# Altium project Time4CM4_PCIeCarrier.PrjPcb (part 2 of 2)

## Sheet Dip_Switch.SchDoc
size A4; SheetNumber: 7; SheetTotal: 12
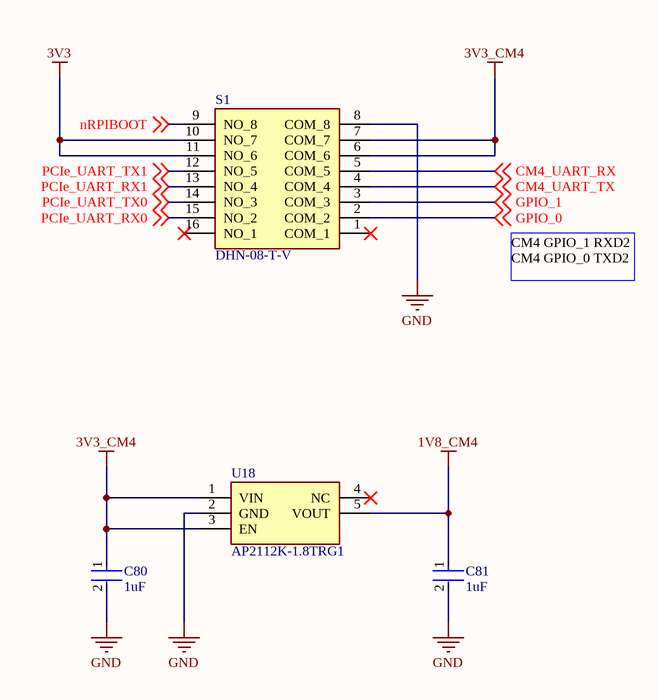
[diagram p7: Dip_Switch.SchDoc]

### Parts
C80  1uF  [FP-CC0805-0_85-MFG]
C81  1uF  [FP-CC0805-0_85-MFG]
S1  DHN-08-T-V  [DHN08TV]
U18  AP2112K-1.8TRG1  [SOT95P285X140-5N]

### Nets
1V8_CM4: C81.1 U18.5(VOUT)
3V3: S1.10(NO_7) S1.11(NO_6)
3V3_CM4: C80.1 S1.6(COM_6) S1.7(COM_7) U18.1(VIN) U18.3(EN)
GND: C80.2 C81.2 S1.8(COM_8) U18.2(GND)
CM4_UART_RX: S1.5(COM_5) ; off-sheet CM4_UART_RX
CM4_UART_TX: S1.4(COM_4) ; off-sheet CM4_UART_TX
GPIO_0: S1.2(COM_2) ; off-sheet GPIO_0
GPIO_1: S1.3(COM_3) ; off-sheet GPIO_1
nRPIBOOT: S1.9(NO_8) ; off-sheet nRPIBOOT
PCIe_UART_RX0: S1.15(NO_2) ; off-sheet PCIe_UART_RX0
PCIe_UART_RX1: S1.13(NO_4) ; off-sheet PCIe_UART_RX1
PCIe_UART_TX0: S1.14(NO_3) ; off-sheet PCIe_UART_TX0
PCIe_UART_TX1: S1.12(NO_5) ; off-sheet PCIe_UART_TX1

Not connected (* = marked no-connect by the designer): S1 1(COM_1)* 16(NO_1)*; U18 4(NC)*

### Notes on the sheet
- CM4 GPIO_1 RXD2
  CM4 GPIO_0 TXD2

### Library data of the parts
C80 C81 = CMP-03422-000182-1: CAP CER 1UF 10V X7R 0805; Manufacturer: Yageo; Manufacturer Part Number: CC0805KKX7R6BB105; Material: Ceramic; Tolerance: 0.1; Value: 1 uF; ComponentLink2URL: http://www.yageo.com/documents/recent/UPY-GPHC_Y5V_6.3V-to-50V_8.pdf; Automotive: No; Temperature Range Low: -30°C; Octopart: https://octopart.com/cc0805kkx7r6bb105-yageo-42522859; Temperature Characteristic: X7R; RoHS: TRUE; Voltage Rating: 10 V; Capacitance: 1 uF; Package: CC0805-0.85; Device Class L3: Ceramic Capacitors; Category: Cap; Mouser Description: Multilayer Ceramic Capacitors MLCC - SMD/SMT 1.0uF 10V X7R 10%; Temperature Range High: +85°C; Ipc Land Pattern Name: CAPC200125X85; ComponentLink2Description: Datasheet; Temperature: -30°C to +85°C; Height: 0.95mm; Lead Free: Yes; Device Class L1: Passive Components; Device Class L2: Capacitors; Footprint Url: http://www.yageo.com/exep/pages/download/literatures/UPY-C_GEN_24.pdf; Digikey Description: CAP CER 1UF 10V X7R 0805
S1 = DHN-08-T-V: Switch; Manufacturer_Name: Diptronics; Datasheet Link: https://componentsearchengine.com/Datasheets/1/DHN-08-T-V.pdf; Height: 1.65mm; Manufacturer_Part_Number: DHN-08-T-V; Mouser Part Number: 113-DHN-08-T-V; Mouser Price/Stock: https://www.mouser.com/Search/Refine.aspx?Keyword=113-DHN-08-T-V
U18 = AP2112K-1.8TRG1: Integrated Circuit; Manufacturer_Name: Diodes Inc.; Datasheet Link: https://www.diodes.com/assets/Datasheets/AP2112.pdf; Height: 1.4mm; Manufacturer_Part_Number: AP2112K-1.8TRG1; Mouser Part Number: 621-AP2112K-1.8TRG1; Mouser Price/Stock: https://www.mouser.co.uk/ProductDetail/Diodes-Incorporated/AP2112K-1.8TRG1?qs=x6A8l6qLYDBx1xhw8AX2cw%3D%3D; Arrow Part Number: AP2112K-1.8TRG1; Arrow Price/Stock: https://www.arrow.com/en/products/ap2112k-1.8trg1/diodes-incorporated?region=nac

## Sheet 40_Pin_Connector.SchDoc
size A4; SheetNumber: 7; SheetTotal: 11
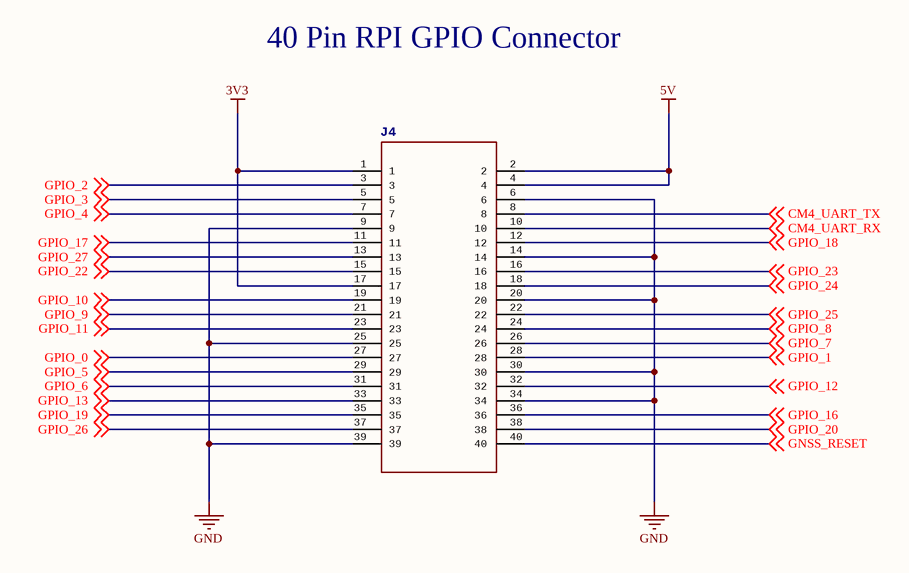
[diagram p8: 40_Pin_Connector.SchDoc]

### Parts
J4  SAMTEC-A-HTSW-120-08-F-DJ  [SAMTEC-A-HTSW-120-08-F-D]  (value not drawn)

### Nets
3V3: J4.1 J4.17
5V: J4.2 J4.4
GND: J4.6 J4.9 J4.14 J4.20 J4.25 J4.30 J4.34 J4.39
CM4_UART_RX: J4.10 ; off-sheet CM4_UART_RX
CM4_UART_TX: J4.8 ; off-sheet CM4_UART_TX
GNSS_RESET: J4.40 ; off-sheet GNSS_RESET
GPIO_0: J4.27 ; off-sheet GPIO_0
GPIO_1: J4.28 ; off-sheet GPIO_1
GPIO_2: J4.3 ; off-sheet GPIO_2
GPIO_3: J4.5 ; off-sheet GPIO_3
GPIO_4: J4.7 ; off-sheet GPIO_4
GPIO_5: J4.29 ; off-sheet GPIO_5
GPIO_6: J4.31 ; off-sheet GPIO_6
GPIO_7: J4.26 ; off-sheet GPIO_7
GPIO_8: J4.24 ; off-sheet GPIO_8
GPIO_9: J4.21 ; off-sheet GPIO_9
GPIO_10: J4.19 ; off-sheet GPIO_10
GPIO_11: J4.23 ; off-sheet GPIO_11
GPIO_12: J4.32 ; off-sheet GPIO_12
GPIO_13: J4.33 ; off-sheet GPIO_13
GPIO_16: J4.36 ; off-sheet GPIO_16
GPIO_17: J4.11 ; off-sheet GPIO_17
GPIO_18: J4.12 ; off-sheet GPIO_18
GPIO_19: J4.35 ; off-sheet GPIO_19
GPIO_20: J4.38 ; off-sheet GPIO_20
GPIO_22: J4.15 ; off-sheet GPIO_22
GPIO_23: J4.16 ; off-sheet GPIO_23
GPIO_24: J4.18 ; off-sheet GPIO_24
GPIO_25: J4.22 ; off-sheet GPIO_25
GPIO_26: J4.37 ; off-sheet GPIO_26
GPIO_27: J4.13 ; off-sheet GPIO_27

### Notes on the sheet
- 40 Pin RPI GPIO Connector

## Sheet PCIe_USB30.SchDoc
size A4; SheetNumber: 9; SheetTotal: 12
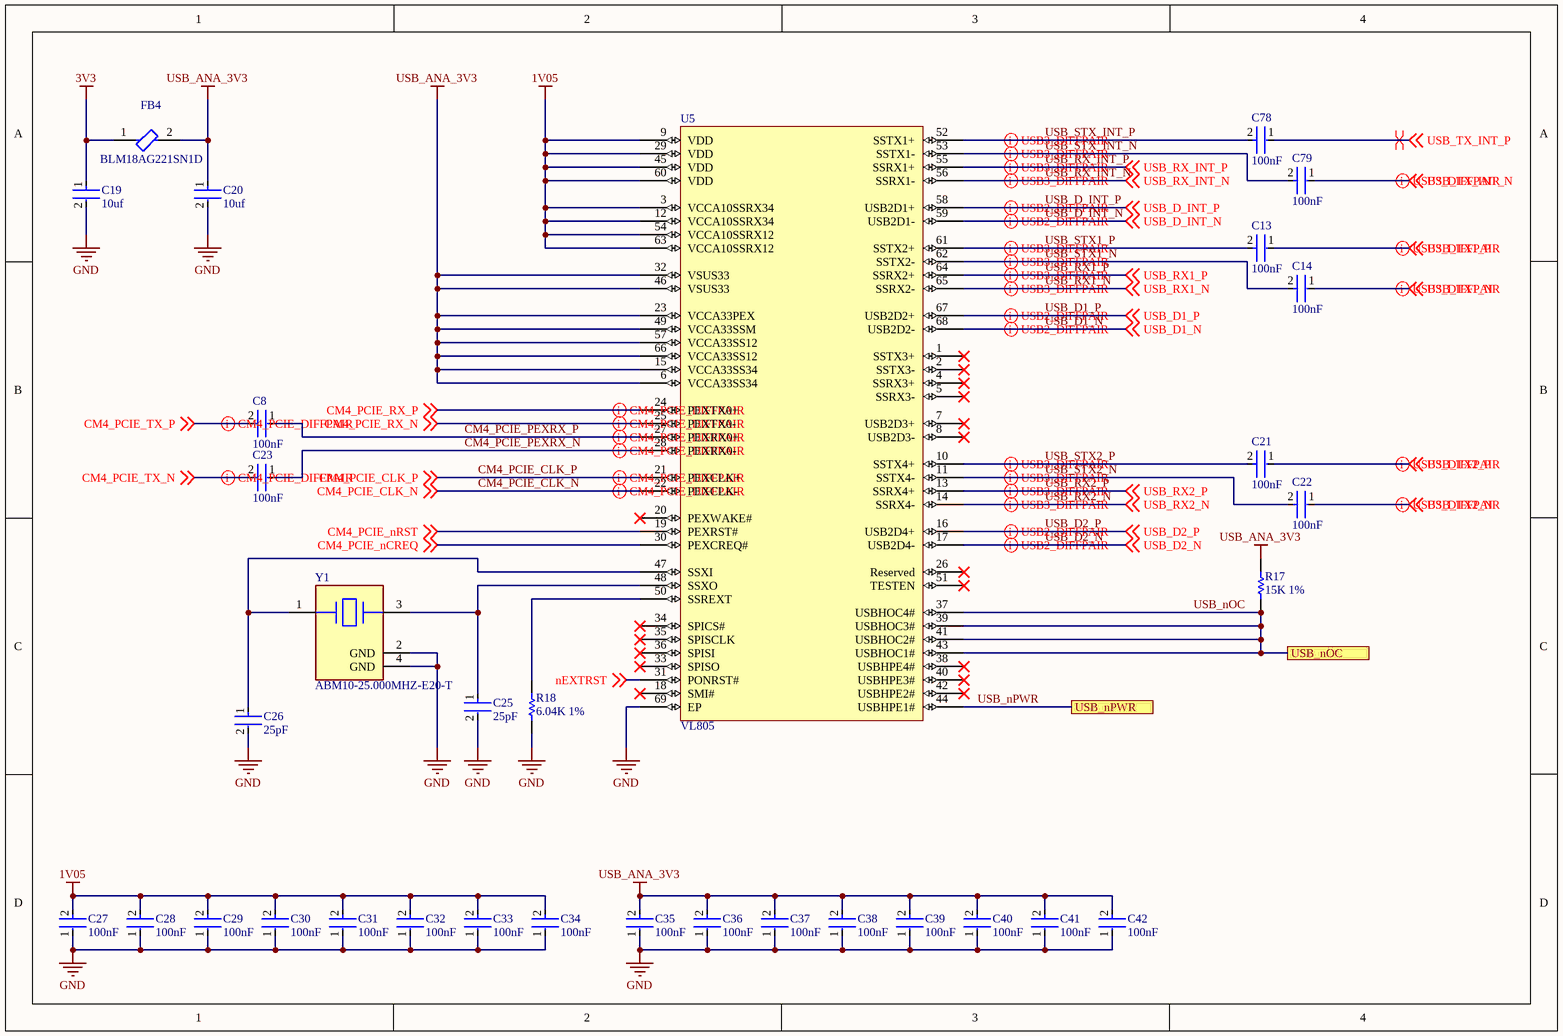
[diagram p9: PCIe_USB30.SchDoc]

### Parts
C8  100nF  [FP-GRM15-MFG]
C13  100nF  [FP-GRM15-MFG]
C14  100nF  [FP-GRM15-MFG]
C19  10uf  [FP-GRM188-0_2-IPC_C]
C20  10uf  [FP-GRM188-0_2-IPC_C]
C21  100nF  [FP-GRM15-MFG]
C22  100nF  [FP-GRM15-MFG]
C23  100nF  [FP-GRM15-MFG]
C25  25pF  [FP-C0402-BB-MFG]
C26  25pF  [FP-C0402-BB-MFG]
C27  100nF  [FP-GRM15-MFG]
C28  100nF  [FP-GRM15-MFG]
C29  100nF  [FP-GRM15-MFG]
C30  100nF  [FP-GRM15-MFG]
C31  100nF  [FP-GRM15-MFG]
C32  100nF  [FP-GRM15-MFG]
C33  100nF  [FP-GRM15-MFG]
C34  100nF  [FP-GRM15-MFG]
C35  100nF  [FP-GRM15-MFG]
C36  100nF  [FP-GRM15-MFG]
C37  100nF  [FP-GRM15-MFG]
C38  100nF  [FP-GRM15-MFG]
C39  100nF  [FP-GRM15-MFG]
C40  100nF  [FP-GRM15-MFG]
C41  100nF  [FP-GRM15-MFG]
C42  100nF  [FP-GRM15-MFG]
C78  100nF  [FP-GRM15-MFG]
C79  100nF  [FP-GRM15-MFG]
FB4  BLM18AG221SN1D  [FP-BLM18-0_15-t0_8-IPC_A]
R17  15K 1%  [RESC1005X40X25ML05T10]
R18  6.04K 1%  [RESC1005X40X25LL05T10]
U5  VL805  [VL805]
Y1  ABM10-25.000MHZ-E20-T  [FP-ABM10-MFG]

### Ports
USB_nOC, USB_nPWR

### Nets
1V05: C27.2 C28.2 C29.2 C30.2 C31.2 C32.2 C33.2 C34.2 U5.3(VCCA10SSRX34) U5.9(VDD) U5.12(VCCA10SSRX34) U5.29(VDD) U5.45(VDD) U5.54(VCCA10SSRX12) U5.60(VDD) U5.63(VCCA10SSRX12)
3V3: C19.1 FB4.1
GND: C19.2 C20.2 C25.2 C26.2 C27.1 C28.1 C29.1 C30.1 C31.1 C32.1 C33.1 C34.1 C35.1 C36.1 C37.1 C38.1 C39.1 C40.1 C41.1 C42.1 R18.1 U5.69(EP) Y1.2(GND) Y1.4(GND)
USB_ANA_3V3: C20.1 C35.2 C36.2 C37.2 C38.2 C39.2 C40.2 C41.2 C42.2 FB4.2 R17.2 U5.6(VCCA33SS34) U5.15(VCCA33SS34) U5.23(VCCA33PEX) U5.32(VSUS33) U5.46(VSUS33) U5.49(VCCA33SSM) U5.57(VCCA33SS12) U5.66(VCCA33SS12)
CM4_PCIE_CLK_N: U5.22(PEXCLK-) ; off-sheet CM4_PCIE_CLK_N
CM4_PCIE_CLK_P: U5.21(PEXCLK+) ; off-sheet CM4_PCIE_CLK_P
CM4_PCIE_nCREQ: U5.30(PEXCREQ#) ; off-sheet CM4_PCIE_nCREQ
CM4_PCIE_nRST: U5.19(PEXRST#) ; off-sheet CM4_PCIE_nRST
CM4_PCIE_PEXRX_N: C23.1 U5.28(PEXRX0-)
CM4_PCIE_PEXRX_P: C8.1 U5.27(PEXRX0+)
CM4_PCIE_RX_N: U5.25(PEXTX0-) ; off-sheet CM4_PCIE_RX_N
CM4_PCIE_RX_P: U5.24(PEXTX0+) ; off-sheet CM4_PCIE_RX_P
CM4_PCIE_TX_N: C23.2 ; off-sheet CM4_PCIE_TX_N
CM4_PCIE_TX_P: C8.2 ; off-sheet CM4_PCIE_TX_P
nEXTRST: U5.31(PONRST#) ; off-sheet nEXTRST
USB_D1_N: U5.68(USB2D2-) ; off-sheet USB_D1_N
USB_D1_P: U5.67(USB2D2+) ; off-sheet USB_D1_P
USB_D2_N: U5.17(USB2D4-) ; off-sheet USB_D2_N
USB_D2_P: U5.16(USB2D4+) ; off-sheet USB_D2_P
USB_D_INT_N: U5.59(USB2D1-) ; off-sheet USB_D_INT_N
USB_D_INT_P: U5.58(USB2D1+) ; off-sheet USB_D_INT_P
USB_nOC: R17.1 U5.37(USBHOC4#) U5.39(USBHOC3#) U5.41(USBHOC2#) U5.43(USBHOC1#) ; port USB_nOC
USB_nPWR: U5.44(USBHPE1#) ; port USB_nPWR
USB_RX1_N: U5.65(SSRX2-) ; off-sheet USB_RX1_N
USB_RX1_P: U5.64(SSRX2+) ; off-sheet USB_RX1_P
USB_RX2_N: U5.14(SSRX4-) ; off-sheet USB_RX2_N
USB_RX2_P: U5.13(SSRX4+) ; off-sheet USB_RX2_P
USB_RX_INT_N: U5.56(SSRX1-) ; off-sheet USB_RX_INT_N
USB_RX_INT_P: U5.55(SSRX1+) ; off-sheet USB_RX_INT_P
USB_STX1_N: C14.2 U5.62(SSTX2-)
USB_STX1_P: C13.2 U5.61(SSTX2+)
USB_STX2_N: C22.2 U5.11(SSTX4-)
USB_STX2_P: C21.2 U5.10(SSTX4+)
USB_STX_INT_N: C79.2 U5.53(SSTX1-)
USB_STX_INT_P: C78.2 U5.52(SSTX1+)
USB_TX1_N: C14.1 ; off-sheet USB_TX1_N
USB_TX1_P: C13.1 ; off-sheet USB_TX1_P
USB_TX2_N: C22.1 ; off-sheet USB_TX2_N
USB_TX2_P: C21.1 ; off-sheet USB_TX2_P
USB_TX_INT_N: C79.1 ; off-sheet USB_TX_INT_N
USB_TX_INT_P: C78.1 ; off-sheet USB_TX_INT_P
NetC25_1: C25.1 U5.48(SSXO) Y1.3
NetC26_1: C26.1 U5.47(SSXI) Y1.1
NetR18_2: R18.2 U5.50(SSREXT)

Not connected (* = marked no-connect by the designer): U5 1(SSTX3+)* 2(SSTX3-)* 4(SSRX3+)* 5(SSRX3-)* 7(USB2D3+)* 8(USB2D3-)* 18(SMI#)* 20(PEXWAKE#)* 26(Reserved)* 33(SPISO)* 34(SPICS#)* 35(SPISCLK)* 36(SPISI)* 38(USBHPE4#)* 40(USBHPE3#)* 42(USBHPE2#)* 51(TESTEN)*

### Layout directives
differential pair; differential pair class PCIe: CM4_PCIE_CLK_N, CM4_PCIE_CLK_P, CM4_PCIE_PEXRX_N, CM4_PCIE_PEXRX_P, CM4_PCIE_RX_N, CM4_PCIE_RX_P, CM4_PCIE_TX_N, CM4_PCIE_TX_P, USB_TX1_P
differential pair; differential pair class USB3: USB_RX1_N, USB_RX1_P, USB_RX2_N, USB_RX2_P, USB_RX_INT_N, USB_RX_INT_P, USB_STX1_N, USB_STX1_P, USB_STX2_N, USB_STX2_P, USB_STX_INT_N, USB_STX_INT_P, USB_TX1_N, USB_TX2_N, USB_TX2_P, USB_TX_INT_N
differential pair; differential pair class USB2: USB_D1_N, USB_D1_P, USB_D2_N, USB_D2_P, USB_D_INT_N, USB_D_INT_P
differential pair: USB_TX_INT_P

### Library data of the parts
C8 C13 C14 C21-C23 C27-C42 C78 C79 = CMP-2100-03641-2: CAP CER 0.1UF 16V X7R 0402; Manufacturer Part Number: GRM155R71C104KA88D; Manufacturer: Murata; Standoff Height: 0mm; Tolerance: 10%; Voltage Rating: 16Vdc; Material: Ceramic; Capacitance: 0.10μF; Value: 0.10μF; RoHS: TRUE; Temperature Characteristic: X7R; Octopart: https://octopart.com/grm155r71c104ka88d-murata-196880; Digikey Description: CAP CER 0.1UF 16V X7R 0402; Device Class L3: Ceramic Capacitors; Height: 0.55mm; ComponentLink2Description: Datasheet; Temperature Range Low: -55°C; Ipc Land Pattern Name: CAPC10050X219; ComponentLink2URL: https://search.murata.co.jp/Ceramy/image/img/A01X/G101/ENG/GRM155R71H471KA01-01A.pdf; Device Class L1: Passive Components; Lead Free: yes; Category: Cap; Package: GRM15; Temperature: -55°C to +125°C; Device Class L2: Capacitors; Temperature Range High: +125°C; Mouser Description: 0402 0.1 uF 16V ±10 % Tolerance X7R SMT Multilayer Ceramic Capacitor
C19 C20 = CMP-06035-045466-1: Chip Multilayer Ceramic Capacitors for General Purpose, 0603, 10uF, X5R, 15%, 20%, 35V; Case Code (Imperial): 0603; Voltage Rating (DC): 35V; Width: 0.031inch; Dielectric: X5R; Voltage Rating: 35V; Min Operating Temperature: -55°C; Thickness: 0.039inch; Mount: Surface Mount; Case/Package: 0603; Length: 0.063inch; Capacitance: 10uF; Max Operating Temperature: 85°C; Packaging: Tape and Reel; Tolerance: 20%; Case Code (Metric): 1608
C25 C26 = CMP-2008-03091-2: CAP CER 12PF 25V NP0 0402; Manufacturer: Kemet; Manufacturer Part Number: C0402C120J3GACTU; Temperature Coefficient: 15%; Temperature Characteristic: C0G; Material: Ceramic; Tolerance: 0.05; Mouser Description: Cap Ceramic 12pF 25V C0G 5% SMD 0402 125°C Paper T/R; Package: C0402-BB; Height: 0.55mm; Temperature: -55°C to +125°C; RoHS: TRUE; ComponentLink2Description: Datasheet; Capacitance: 12 pF; Temperature Range Low: -55°C; Automotive: No; Device Class L2: Capacitors; ComponentLink2URL: https://content.kemet.com/datasheets/KEM_C1002_X7R_SMD.pdf; Voltage Rating: 25 V; Device Class L1: Passive Components; Value: 12 pF; Digikey Description: CAP CER 12PF 25V NP0 0402; Lead Free: Yes; Category: Cap; Ipc Land Pattern Name: CAPC10050X50; Device Class L3: Ceramic Capacitors; Octopart: https://octopart.com/c0402c120j3gactu-kemet-9143703; Temperature Range High: +125°C
FB4 = CMP-0686-00445-3: Chip Ferrite Bead, 0603, 220Ω @ 100MHz, 0.25Ω, 25%, 700mA; DC Current: 500mA; DC Resistance-Max: 250mR; Shielding: Unshielded; Material: Steel; Impedance: 220R; Number of Lines: 1; Max Operating Temperature: 125°C; Military Standard: Not; Min Operating Temperature: -55°C; Max DC Current: 500mA; Case/Package: 0603; Termination: SMD/SMT; Current Rating: 500mA; REACH SVHC: No SVHC; Depth: 0.8mm; Number of Pins: 2; Radiation Hardening: No; Length: 1.6mm; Packaging: Tape and Reel; Test Frequency: 100MHz; Series: BLM18A; Package Quantity: 1; Tolerance: 25%; Case Code (Imperial): 0603; DC Resistance (DCR): 250mR; Height: 0.8mm; Lead Free: Lead Free; Width: 0.8mm; Case Code (Metric): 1608; RoHS Compliant: Yes; Frequency: 100MHz; Core Material: Ferrite; Number of Circuits: 1; Max Current Rating: 500mA
R17 = CMP-2002-07410-1: Manufacturer: Yageo / Phycomp; Part Number: RC0402FR0715KL
R18 = CMP-2002-07778-1: Part Number: RC0402FR-076K04L; Manufacturer: Yageo
Y1 = CMP-27762-004420-1: Crystal 25MHz ±20ppm 10pF SMD-4 2.5mm x 2mm; ESR (Equivalent Series Resistance): 100R; Frequency Stability: 20ppm; Termination: SMD/SMT; Height: 0.02inch; Depth: 2mm; Lead Free: Lead Free; Case/Package: CSMD; Operating Frequency: 25 MHz; Frequency Tolerance: 20ppm; Tolerance: 20ppm; Width: 2mm; Frequency: 25MHz; Packaging: Tape and Reel; Min Operating Temperature: -20°C; Max Operating Temperature: 70°C; Length: 2.5mm; Series: ABM10; REACH SVHC: No SVHC; Mount: Surface Mount; Package Quantity: 1000; Load Capacitance: 10pF; Number of Pins: 4; Series Resistance: 100R

## Sheet PCIe_USB30_Power.SchDoc
size A4; SheetNumber: 10; SheetTotal: 11
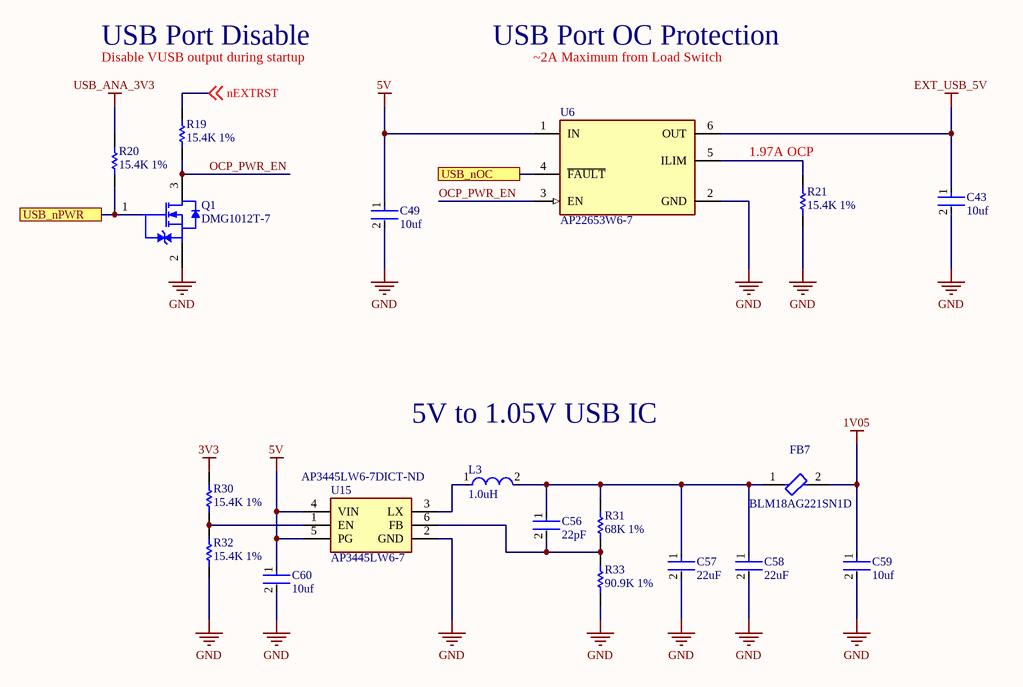
[diagram p10: PCIe_USB30_Power.SchDoc]

### Parts
C43  10uf  [FP-GRM188-0_2-IPC_C]
C49  10uf  [FP-GRM188-0_2-IPC_C]
C56  22pF  [FP-C0603C-CF-MFG]
C57  22uF  [FP-GRM21B-0_15-MFG]
C58  22uF  [FP-GRM21B-0_15-MFG]
C59  10uf  [FP-GRM188-0_2-IPC_C]
C60  10uf  [FP-GRM188-0_2-IPC_C]
FB7  BLM18AG221SN1D  [FP-BLM18-0_15-t0_8-IPC_A]
L3  1.0uH  [FP-NR4018-MFG]
Q1  DMG1012T-7  [DIOD-SOT523-3_V]
R19  15.4K 1%  [RESC1005X40X25ML05T10]
R20  15.4K 1%  [RESC1005X40X25ML05T10]
R21  15.4K 1%  [RESC1005X40X25ML05T10]
R30  15.4K 1%  [RESC1005X40X25ML05T10]
R31  68K 1%  [RESC1005X40X25ML05T05]
R32  15.4K 1%  [RESC1005X40X25ML05T10]
R33  90.9K 1%  [RESC1005X40X25NL05T10]
U6  AP22653W6-7  [FP-SOT26-MFG]
U15  AP3445LW6-7  Supplier Part Number 1: AP3445LW6-7DICT-ND  [SOT95P285X140-6N]

### Ports
USB_nOC, USB_nPWR

### Nets
1V05: C59.1 FB7.2
3V3: R30.2
5V: C49.1 C60.1 U6.1(IN) U15.4(VIN) U15.5(PG)
EXT_USB_5V: C43.1 U6.6(OUT)
GND: C43.2 C49.2 C57.2 C58.2 C59.2 C60.2 Q1.2(S) R21.1 R32.1 R33.1 U6.2(GND) U15.2(GND)
USB_ANA_3V3: R20.2
nEXTRST: R19.2 ; off-sheet nEXTRST
OCP_PWR_EN: Q1.3(D) R19.1 U6.3(EN)
USB_nOC: U6.4(~{FAULT}) ; port USB_nOC
USB_nPWR: Q1.1(G) R20.1 ; port USB_nPWR
NetC56_1: C56.1 C57.1 C58.1 FB7.1 L3.2 R31.1
NetC56_2: C56.2 R31.2 R33.2 U15.6(FB)
NetL3_1: L3.1 U15.3(LX)
NetR21_2: R21.2 U6.5(ILIM)
NetR30_1: R30.1 R32.2 U15.1(EN)

### Notes on the sheet
- USB Port Disable
- Disable VUSB output during startup
- USB Port OC Protection
- ~2A Maximum from Load Switch
- (near R21) 1.97A OCP
- 5V to 1.05V USB IC

### Library data of the parts
C43 C49 C59 C60 = CMP-06035-045466-1: as C19 on sheet PCIe_USB30; Case Code (Imperial): 0603; Voltage Rating (DC): 35V; Width: 0.031inch; Dielectric: X5R; Voltage Rating: 35V; Min Operating Temperature: -55°C; Thickness: 0.039inch; Mount: Surface Mount; Case/Package: 0603; Length: 0.063inch; Capacitance: 10uF; Max Operating Temperature: 85°C; Packaging: Tape and Reel; Tolerance: 20%; Case Code (Metric): 1608
C56 = CMP-1035-00818-3: CAP CER 22PF 50V NP0 0603; Manufacturer Part Number: C0603C220D5GACTU; Manufacturer: KEMET; Temperature Coefficient: 30ppm/°C; Tolerance: 0.5 pF; Automotive Grade: Grade 1; Material: Ceramic; Temperature Characteristic: C0G; Category: Cap; Octopart: https://octopart.com/c0603c220d5gactu-kemet-9143734; Package: C0603C-CF; ComponentLink2Description: Datasheet; Temperature: -55°C to +125°C; RoHS: TRUE; Digikey Description: CAP CER 22PF 50V NP0 0603; Lead Free: Yes; ComponentLink2URL: https://api.kemet.com/component-edge/download/datasheet/C0603C100J5GACAUTO.pdf; Mouser Description: Multilayer Ceramic Capacitors MLCC - SMD/SMT 50volts 22pF C0G 0.5%; Temperature Range Low: -55°C; Temperature Range High: +125°C; Device Class L1: Passive Components; Device Class L2: Capacitors; Device Class L3: Ceramic Capacitors; Voltage Rating: 50 V; Automotive: Yes; Capacitance: 22 pF; Height: 0.87mm; Value: 22 pF
C57 C58 = CMP-2007-03385-2: Chip Multilayer Ceramic Capacitors for General Purpose, 0805, 22uF, X5R, 15%, 20%, 6.3V; Material: Ceramic; Max Operating Temperature: 85°C; Voltage: 6.3V; Min Operating Temperature: -55°C; Case/Package: 0805; Thickness: 0.053inch; Dielectric: X5R; Packaging: Tape and Reel; Depth: 1.25mm; Termination: SMD/SMT; Voltage Rating (DC): 6.3V; Radiation Hardening: No; Tolerance: 20%; Mount: Surface Mount; Lead Free: Lead Free; Package Quantity: 1; REACH SVHC: No SVHC; Voltage Rating: 6.3V; Capacitance: 22uF; Length: 2mm; Case Code (Imperial): 0805; Case Code (Metric): 2012; Width: 0.049inch; Height: 1.25mm
FB7 = CMP-0686-00445-3: as FB4 on sheet PCIe_USB30; Max Operating Temperature: 125°C; Military Standard: Not; Min Operating Temperature: -55°C; Max DC Current: 500mA; Case/Package: 0603; Termination: SMD/SMT; Current Rating: 500mA; REACH SVHC: No SVHC; Depth: 0.8mm; Number of Pins: 2; Radiation Hardening: No; Length: 1.6mm; Packaging: Tape and Reel; Test Frequency: 100MHz; Series: BLM18A; Package Quantity: 1; Tolerance: 25%; Case Code (Imperial): 0603; DC Resistance (DCR): 250mR; Height: 0.8mm; Lead Free: Lead Free; Width: 0.8mm; Case Code (Metric): 1608; RoHS Compliant: Yes; Frequency: 100MHz; Core Material: Ferrite; Number of Circuits: 1; Max Current Rating: 500mA
L3 = CMP-14484-000491-1: SMD Power Inductors for Automotive Applications 1.0uH ±30% 3.2A 32.4mΩ; Shielding: Shielded; Saturation Current: 4A; Core Material: Ferrite; Test Frequency: 100kHz; Inductance: 1uH; Self Resonant Frequency: 90MHz; DC Resistance (DCR): 32.4mR; Package Quantity: 3500; Resistor Type: Wirewound; Halogen Free: Halogen Free; Width: 0.157inch; Termination: SMD/SMT; Packaging: Tape and Reel; Max DC Current: 3.2A; Case/Package: Nonstandard; Current Rating: 3.2A; RoHS Compliant: Yes; Height: 1.8mm; Tolerance: 30%; Length: 4mm; Weight: 0.003527oz; Ratings: AEC-Q200; Mount: Surface Mount; Max Operating Temperature: 125°C; Height - Seated (Max): 0.071inch; Min Operating Temperature: -40°C
Q1 = CMP-2000-07450-1: N-Channel Enhancement Mode MOSFET, 20 V, 630 mA, -55 to 150 degC, 3-Pin SOT23, RoHS, Tape and Reel; Manufacturer: Diodes Inc; Continuous Drain Current (ID): 630mA; Number of Channels: 1; Drain to Source Voltage (Vdss): 20V; Gate to Source Voltage (Vgs): 6V; Turn-On Delay Time: 5.1ns; Rds On Max: 400mOhm; Power Dissipation: 280mW; Fall Time: 12.3ns; Input Capacitance: 60.67pF; Turn-Off Delay Time: 26.7ns; Rise Time: 7.4ns; Drain to Source Resistance: 300mOhm; Element Configuration: Single; Case\/Package: SOT-523; Threshold Voltage: 1V; Manufacturer URL: http://www.diodes.com/; Datasheet URL: https://www.diodes.com/assets/Datasheets/ds31783.pdf; Mount: SurfaceMount; Width: 0.85mm; REACH SVHC: NoSVHC; Datasheet Version: Rev. 3-2, 01/2012; Lead Free: LeadFree; Number of Pins: 3; Drain to Source Breakdown Voltage: 20V; Height: 0.8mm; Length: 1.7mm; Radiation Hardening: No; Packaging: TapeandReel; Contact Plating: Matte; Max Operating Temperature: 150degC; RoHSCompliant: true; Weight: 7.1E-05oz; Package Reference: SOT523-3; Package Quantity: 3000; Max Power Dissipation: 280mW; Package Description: 3-Pin Small Outline Transistor, Body 1.6 x 0.8 mm, Pitch 0.5 mm; On-State Resistance: 400MOhm; Min Operating Temperature: -55degC; Number of Elements: 1; Mounting Technology: SurfaceMount
R19-R21 R30 R32 = CMP-1011-00642-2: Part Number: RC0402FR-0715K4L; Manufacturer: Yageo
R31 = CMP-2002-01168-1: Part Number: ERJ2RKF6802X; Manufacturer: Panasonic
R33 = CMP-2002-07837-1: Manufacturer: Yageo; Part Number: RC0402FR-0790K9L
U6 = CMP-12749-000002-1: LOAD SWITCH,SOT26,T&R,3K
U15 = AP3445LW6-7: Integrated Circuit; Manufacturer_Name: Diodes Inc.; Datasheet Link: https://www.mouser.com/datasheet/2/115/AP3445-L-1382378.pdf; Height: 1.4mm; Manufacturer_Part_Number: AP3445LW6-7; Mouser Part Number: 621-AP3445LW6-7; Mouser Price/Stock: https://www.mouser.co.uk/ProductDetail/Diodes-Incorporated/AP3445LW6-7?qs=%252BEew9%252B0nqrAxy08hG7uGeQ%3D%3D; Arrow Part Number: AP3445LW6-7; Arrow Price/Stock: https://www.arrow.com/en/products/ap3445lw6-7/diodes-incorporated; Supplier 1: Digi-Key

## Sheet PCIe_USB30_Conn_Panel_Top.SchDoc
size A; SheetNumber: 11; SheetTotal: 12
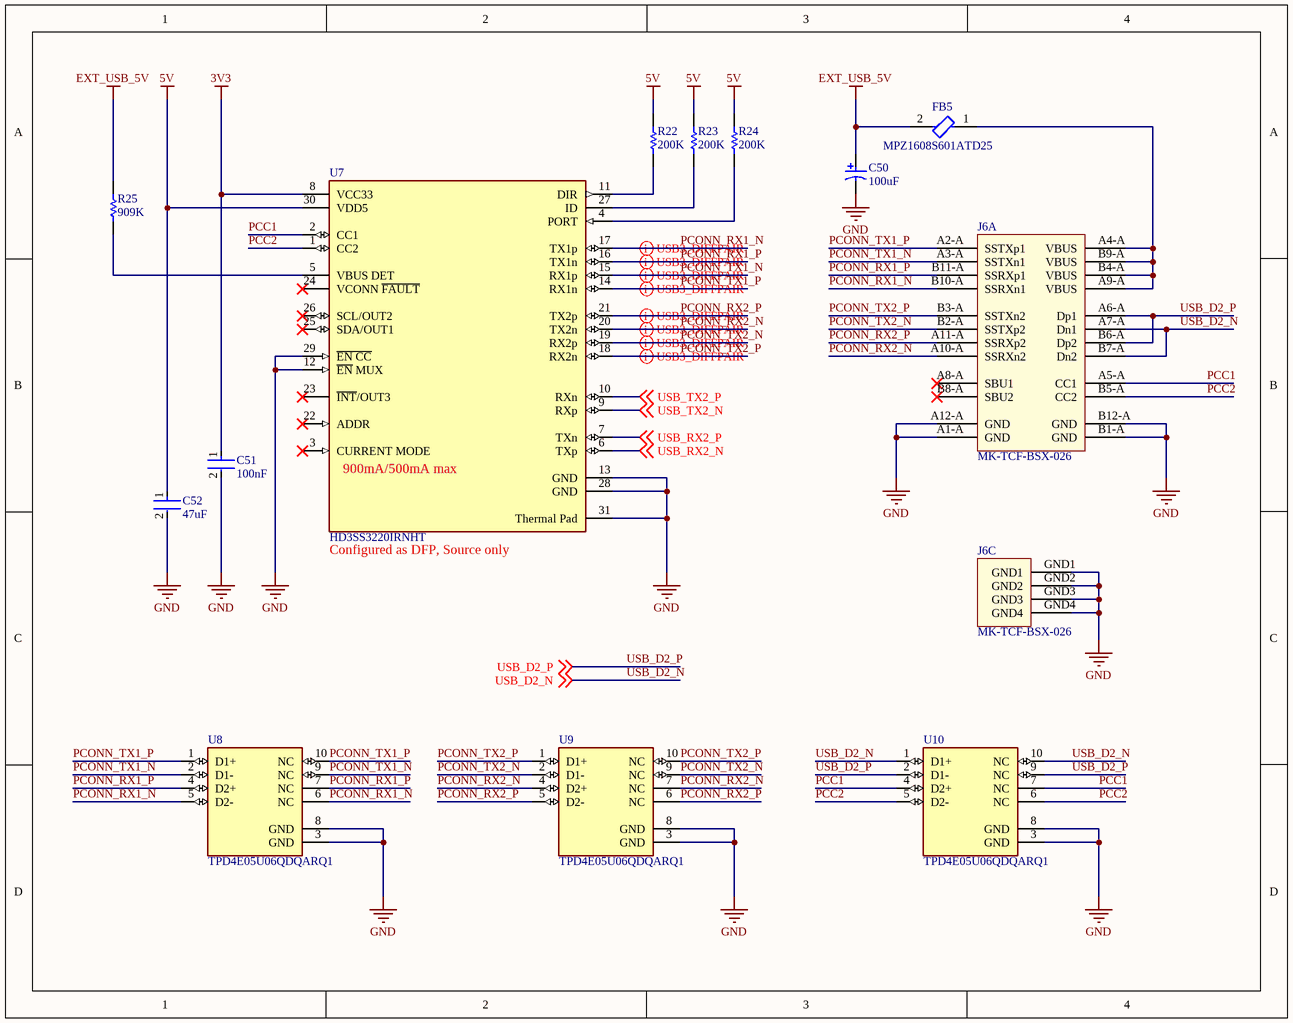
[diagram p11: PCIe_USB30_Conn_Panel_Top.SchDoc]

### Parts
C50  100uF  [PNSC-EEEFK1C101P_L]
C51  100nF  [FP-C0402-BB-MFG]
C52  47uF  [FP-C2012-125-0_2-IPC_B]
FB5  MPZ1608S601ATD25  [FP-MPZ1608-0_8-IPC_B]
J6  MK-TCF-BSX-026  [MK-TCF-BSX-026]  (parts A,C of 3)
R22  200K  [RESC1005X40X25NL05T05]
R23  200K  [RESC1005X40X25NL05T05]
R24  200K  [RESC1005X40X25NL05T05]
R25  909K  [RESC1005X40X25NL05T10]
U7  HD3SS3220IRNHT  [FP-RNH0030A-MFG]
U8  TPD4E05U06QDQARQ1  [FP-DQA0010A-MFG]
U9  TPD4E05U06QDQARQ1  [FP-DQA0010A-MFG]
U10  TPD4E05U06QDQARQ1  [FP-DQA0010A-MFG]

### Nets
3V3: C51.1 U7.8(VCC33)
5V: C52.1 R22.2 R23.2 R24.2 U7.30(VDD5)
EXT_USB_5V: C50.1 FB5.2 R25.2
GND: C50.2 C51.2 C52.2 J6.A1-A(GND) J6.A12-A(GND) J6.B1-A(GND) J6.B12-A(GND) J6.GND1 J6.GND2 J6.GND3 J6.GND4 U7.12(~{EN}_MUX) U7.13(GND) U7.28(GND) U7.29(~{EN_CC}) U7.31(Thermal_Pad) U8.3(GND) U8.8(GND) U9.3(GND) U9.8(GND) U10.3(GND) U10.8(GND)
PCC1: J6.A5-A(CC1) U7.2(CC1) U10.4(D2+) U10.7(NC)
PCC2: J6.B5-A(CC2) U7.1(CC2) U10.5(D2-) U10.6(NC)
PCONN_RX1_N: J6.B10-A(SSRXn1) U7.17(TX1p) U8.5(D2-) U8.6(NC)
PCONN_RX1_P: J6.B11-A(SSRXp1) U7.16(TX1n) U8.4(D2+) U8.7(NC)
PCONN_RX2_N: J6.A10-A(SSRXn2) U7.20(TX2n) U9.4(D2+) U9.7(NC)
PCONN_RX2_P: J6.A11-A(SSRXp2) U7.21(TX2p) U9.5(D2-) U9.6(NC)
PCONN_TX1_N: J6.A3-A(SSTXn1) U7.15(RX1p) U8.2(D1-) U8.9(NC)
PCONN_TX1_P: J6.A2-A(SSTXp1) U7.14(RX1n) U8.1(D1+) U8.10(NC)
PCONN_TX2_N: J6.B2-A(SSTXp2) U7.19(RX2p) U9.2(D1-) U9.9(NC)
PCONN_TX2_P: J6.B3-A(SSTXn2) U7.18(RX2n) U9.1(D1+) U9.10(NC)
USB_D2_N: J6.A7-A(Dn1) J6.B7-A(Dn2) U10.1(D1+) U10.10(NC) ; off-sheet USB_D2_N
USB_D2_P: J6.A6-A(Dp1) J6.B6-A(Dp2) U10.2(D1-) U10.9(NC) ; off-sheet USB_D2_P
USB_RX2_N: U7.6(TXp) ; off-sheet USB_RX2_N
USB_RX2_P: U7.7(TXn) ; off-sheet USB_RX2_P
USB_TX2_N: U7.9(RXp) ; off-sheet USB_TX2_N
USB_TX2_P: U7.10(RXn) ; off-sheet USB_TX2_P
NetFB5_1: FB5.1 J6.A4-A(VBUS) J6.A9-A(VBUS) J6.B4-A(VBUS) J6.B9-A(VBUS)
NetR22_1: R22.1 U7.11(DIR)
NetR23_1: R23.1 U7.27(ID)
NetR24_1: R24.1 U7.4(PORT)
NetR25_1: R25.1 U7.5(VBUS_DET)

Not connected (* = marked no-connect by the designer): J6 A8-A(SBU1)* B8-A(SBU2)*; U7 3(CURRENT_MODE)* 22(ADDR)* 23(~{INT}/OUT3)* 24(VCONN_~{FAULT})* 25(SDA/OUT1)* 26(SCL/OUT2)*

### Layout directives
differential pair; differential pair class USB3: PCONN_RX1_N, PCONN_RX1_P, PCONN_RX2_N, PCONN_RX2_P, PCONN_TX1_N, PCONN_TX1_P, PCONN_TX2_N, PCONN_TX2_P

### Notes on the sheet
- (near U7) 900mA/500mA max
- (near U7) Configured as DFP, Source only

### Library data of the parts
C50 = CMP-2000-06203-1: Aluminum Electrolytic Capacitor, 100 uF, 20%, 16 V, -55 to 105 degC, 2-Pin SMD, RoHS, Tape and Reel; Manufacturer: Panasonic; Lifetime@Temperature: 2000Hrs@105°C; Impedance: 0.36O; Ripple Current: 240mA; Rated Voltage: 16V; Type: Can; Capacitance: 100µF; Datasheet URL: http://datasheet.octopart.com/EEEFK1C101P-Panasonic-datasheet-13266987.pdf; Package Description: 2-Pin Surface Mount Device, Body 6.6 x 6.6 mm; Manufacturer URL: http://www.panasonic.com/; Case Size/Dimension: Ø6.3x5.8mm; Series: FK; Datasheet Version: 11/2012; Mounting Technology: SurfaceMount; Package Reference: EEEFK1C101P; Operating Temp-Max: 105°C; Operating Temp Range: -55to+105°C
C51 = CMP-2008-02046-2: CAP CER 0.1UF 10V X5R 0402; Manufacturer: Kemet; Manufacturer Part Number: C0402C104K8PACTU; Material: Ceramic; Capacitance: 0.10 μF; Temperature Coefficient: 15%; Tolerance: 0.1; Value: 0.10 μF; Package: C0402-BB; Temperature: -55°C to +125°C; ComponentLink2Description: Datasheet; Temperature Characteristic: X5R; Device Class L1: Passive Components; Height: 0.55mm; Lead Free: Yes; ComponentLink2URL: https://content.kemet.com/datasheets/KEM_C1002_X7R_SMD.pdf; Device Class L2: Capacitors; Temperature Range Low: -55°C; Temperature Range High: +125°C; RoHS: TRUE; Octopart: https://octopart.com/c0402c104k8pactu-kemet-140039; Automotive: No; Mouser Description: Capacitor 100 nF 10 VDC 0402; Category: Cap; Voltage Rating: 10 V; Digikey Description: CAP CER 0.1UF 10V X5R 0402; Ipc Land Pattern Name: CAPC10050X50; Device Class L3: Ceramic Capacitors
C52 = CMP-2000-05451-2: Multilayer Ceramic Capacitors 47μF ±20% 10V X5R SMD 0805; RoHS Compliant: Yes; Dielectric: X5R; Case Code (Imperial): 0805; Min Operating Temperature: -55°C; Capacitance: 47uF; Length: 2mm; Voltage Rating: 10V; Lead Free: Lead Free; Weight: 0.000194oz; Resistor Type: Ceramic; Dielectric Material: Ceramic; Max Operating Temperature: 85°C; Height: 1.25mm; Width: 0.049inch; Depth: 1.25mm; Termination: SMD/SMT; Case/Package: 0805; Voltage Rating (DC): 10V; Voltage: 10V; Thickness: 0.057inch; Tolerance: 20%; REACH SVHC: No SVHC; Package Quantity: 1; Series: C; Case Code (Metric): 2012; Mount: Surface Mount; Packaging: Tape and Reel
FB5 = CMP-08257-000403-1: Power line Ferrite Bead 600Ω @ 100MHz 1A DCR 0.15Ω AEC-Q200 SMD 0603; Number of Lines: 1; DC Resistance (DCR): 150mR; Impedance: 600R; Tolerance: 25%; Length: 0.063inch; Max Operating Temperature: 125°C; Lead Free: Lead Free; Min Operating Temperature: -55°C; Test Frequency: 100MHz; Termination: SMD/SMT; Packaging: Tape and Reel; Package Quantity: 4000; Case Code (Metric): 1608; Series: MPZ; Max Current Rating: 1A; Mount: Surface Mount; Max DC Current: 1A; RoHS Compliant: Yes; Case/Package: 0603; Weight: 7.1E-05oz; Ratings: AEC-Q200; Height: 0.037inch; Width: 0.031inch; Case Code (Imperial): 0603
R22-R24 = CMP-1011-00768-4: Chip Resistor, 200 KOhm, +/- 1%, 100 mW, -55 to 155 degC, 0402 (1005 Metric), RoHS, Tape and Reel; PartNumber: ERJ-2RKF2003X; Manufacturer: Basic Passives; Case\/Package: 0402; Voltage Rating: 50 V; Power Rating: 100 mW; RoHSCompliant: true; Length: 1 mm; DatasheetVersion: 04/2015; ComponentLink2URL: http://industrial.panasonic.com/cdbs/www-data/pdf/RDA0000/AOA0000C86.pdf; Mount: Surface Mount; PackageDescription: 2-Pin Surface Mount Device, Body 1 x 0.5 mm; Tolerance: 1%; Width: 0.5 mm; ComponentLink2Description: Datasheet; Packaging: Tape and Reel; REACH SVHC: No SVHC; Min Operating Temperature: -55 degC; Package Quantity: 10000; ComponentLink1Description: Manufacturer URL; Height: 0.35 mm; ComponentLink1URL: http://www.panasonic.com/; Mounting Technology: Surface Mount; Case Code (Imperial): 0402; PackageReference: 0402; Radiation Hardening: No; Pins: 2; Max Operating Temperature: 155 degC; Resistance: 200 KOhm; Case Code (Metric): 1005
R25 = CMP-1011-00844-2: Manufacturer: Yageo / Phycomp; Part Number: RC0402FR-07909KL
U7 = CMP-04877-000019-1: USB TYPE-C DRP PORT CONTROLLER W; Max Supply Voltage: 5.5V; Min Supply Voltage: 3V; Number of Ports: 1; Data Rate: 10Gbps; USB Standard: USB 3.1; Mount: Surface Mount; Max Operating Temperature: 70°C; Lead Free: Lead Free; RoHS Compliant: Yes; Packaging: Tape and Reel; Number of Pins: 30; Min Operating Temperature: 0°C; REACH SVHC: No SVHC
U8-U10 = CMP-04985-000004-1: TVS DIODE 5.5V 14V 10USON; Manufacturer: Texas Instruments; Direction: Unidirectional; Standoff Height: 0mm; Capacitance: 0.5pF; Number Of Channels: 4; Breakdown Voltage: 6.4V; Peak Pulse Power: 2.5W; Automotive Grade: Grade 1; Value: 0.5pF; Interface: USB,Ethernet,LVDS,Other; Peak Pulse Current: 2.5A; Operating Supply Voltage: 5.5V; Reverse Standoff Voltage: 5.5V; Package: DQA0010A; Temperature Range Low: -40°C; Temperature Range High: +125°C; Ambient Temperature Range Low: -40°C; Device Class L1: Circuit Protection; Clamping Voltage: 14V; Manufacturer Part Number: TPD4E05U06QDQARQ1; Device Class L2: ESD and Circuit Protection ICs; Octopart: https://octopart.com/tpd4e05u06qdqarq1-texas+instruments-48523459; Device Class L3: unset; Height: 0.55mm; Automotive: Yes; ComponentLink2Description: Datasheet; RoHS: TRUE; Ambient Temperature Range High: +125°C; Category: IC; Mouser Description: Automotive 4-Channel ESD Protection Solution for SuperSpeed (up to 5 Gbps) Interface 10-USON -40 to 125; Temperature: -40°C to +125°C; ComponentLink2URL: http://www.ti.com/lit/ds/symlink/tpd4e05u06-q1.pdf; Digikey Description: TVS DIODE 5.5V 14V 10USON; Lead Free: Yes

## Sheet PCIe_USB30_Conn_Panel_Bottom.SchDoc
size A; SheetNumber: 12; SheetTotal: 12
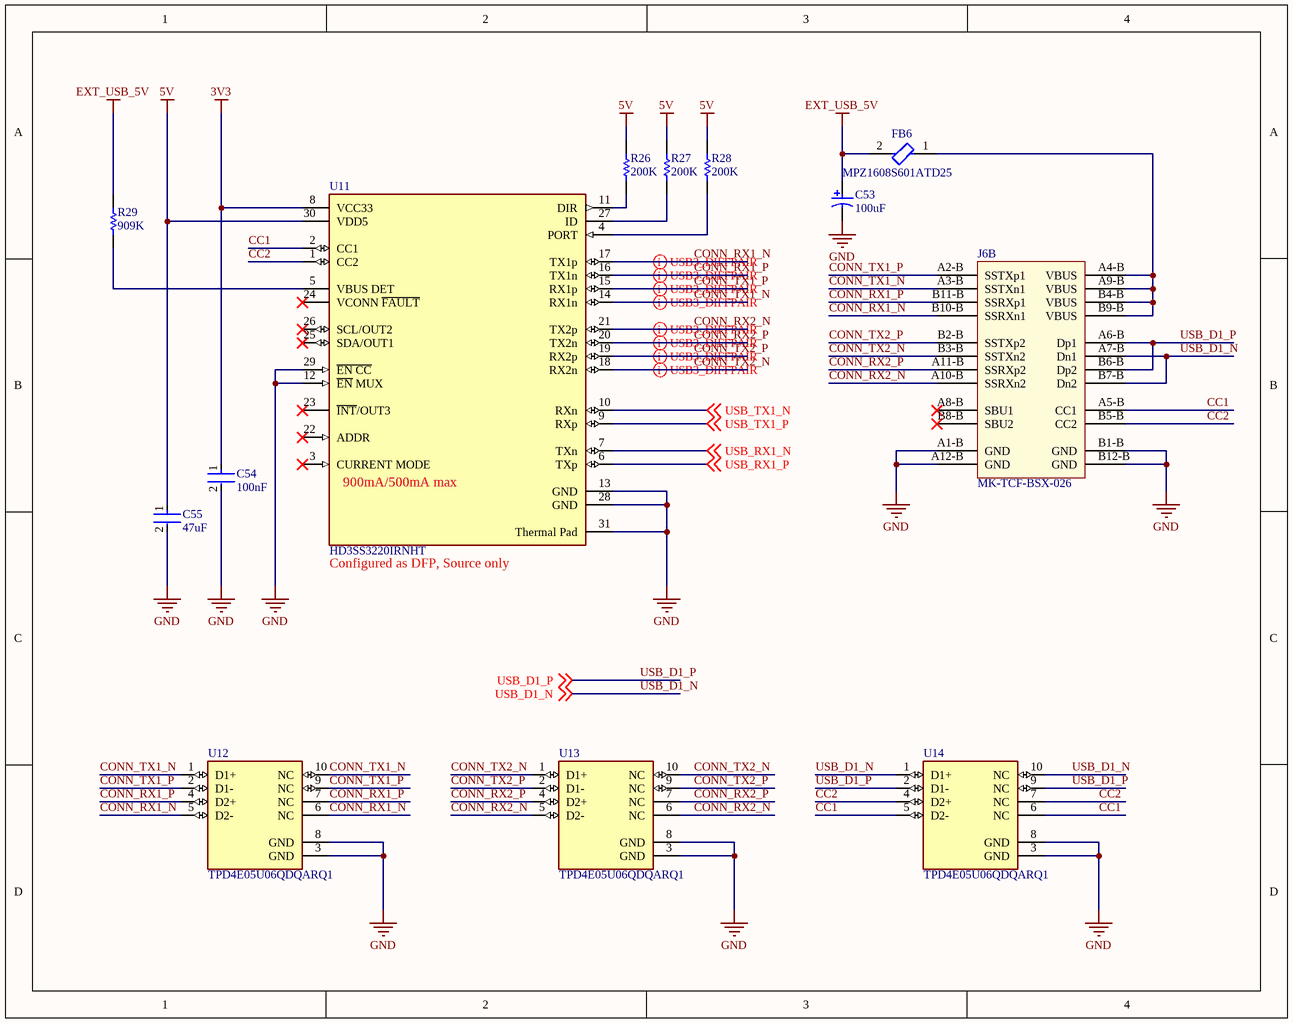
[diagram p12: PCIe_USB30_Conn_Panel_Bottom.SchDoc]

### Parts
C53  100uF  [PNSC-EEEFK1C101P_L]
C54  100nF  [FP-C0402-BB-MFG]
C55  47uF  [FP-C2012-125-0_2-IPC_B]
FB6  MPZ1608S601ATD25  [FP-MPZ1608-0_8-IPC_B]
J6  MK-TCF-BSX-026  [MK-TCF-BSX-026]  (part B of 3)
R26  200K  [RESC1005X40X25NL05T05]
R27  200K  [RESC1005X40X25NL05T05]
R28  200K  [RESC1005X40X25NL05T05]
R29  909K  [RESC1005X40X25NL05T10]
U11  HD3SS3220IRNHT  [FP-RNH0030A-MFG]
U12  TPD4E05U06QDQARQ1  [FP-DQA0010A-MFG]
U13  TPD4E05U06QDQARQ1  [FP-DQA0010A-MFG]
U14  TPD4E05U06QDQARQ1  [FP-DQA0010A-MFG]

### Nets
3V3: C54.1 U11.8(VCC33)
5V: C55.1 R26.2 R27.2 R28.2 U11.30(VDD5)
EXT_USB_5V: C53.1 FB6.2 R29.2
GND: C53.2 C54.2 C55.2 J6.A1-B(GND) J6.A12-B(GND) J6.B1-B(GND) J6.B12-B(GND) U11.12(~{EN}_MUX) U11.13(GND) U11.28(GND) U11.29(~{EN_CC}) U11.31(Thermal_Pad) U12.3(GND) U12.8(GND) U13.3(GND) U13.8(GND) U14.3(GND) U14.8(GND)
CC1: J6.A5-B(CC1) U11.2(CC1) U14.5(D2-) U14.6(NC)
CC2: J6.B5-B(CC2) U11.1(CC2) U14.4(D2+) U14.7(NC)
CONN_RX1_N: J6.B10-B(SSRXn1) U11.17(TX1p) U12.5(D2-) U12.6(NC)
CONN_RX1_P: J6.B11-B(SSRXp1) U11.16(TX1n) U12.4(D2+) U12.7(NC)
CONN_RX2_N: J6.A10-B(SSRXn2) U11.21(TX2p) U13.5(D2-) U13.6(NC)
CONN_RX2_P: J6.A11-B(SSRXp2) U11.20(TX2n) U13.4(D2+) U13.7(NC)
CONN_TX1_N: J6.A3-B(SSTXn1) U11.14(RX1n) U12.1(D1+) U12.10(NC)
CONN_TX1_P: J6.A2-B(SSTXp1) U11.15(RX1p) U12.2(D1-) U12.9(NC)
CONN_TX2_N: J6.B3-B(SSTXn2) U11.18(RX2n) U13.1(D1+) U13.10(NC)
CONN_TX2_P: J6.B2-B(SSTXp2) U11.19(RX2p) U13.2(D1-) U13.9(NC)
USB_D1_N: J6.A7-B(Dn1) J6.B7-B(Dn2) U14.1(D1+) U14.10(NC) ; off-sheet USB_D1_N
USB_D1_P: J6.A6-B(Dp1) J6.B6-B(Dp2) U14.2(D1-) U14.9(NC) ; off-sheet USB_D1_P
USB_RX1_N: U11.7(TXn) ; off-sheet USB_RX1_N
USB_RX1_P: U11.6(TXp) ; off-sheet USB_RX1_P
USB_TX1_N: U11.10(RXn) ; off-sheet USB_TX1_N
USB_TX1_P: U11.9(RXp) ; off-sheet USB_TX1_P
NetFB6_1: FB6.1 J6.A4-B(VBUS) J6.A9-B(VBUS) J6.B4-B(VBUS) J6.B9-B(VBUS)
NetR26_1: R26.1 U11.11(DIR)
NetR27_1: R27.1 U11.27(ID)
NetR28_1: R28.1 U11.4(PORT)
NetR29_1: R29.1 U11.5(VBUS_DET)

Not connected (* = marked no-connect by the designer): J6 A8-B(SBU1)* B8-B(SBU2)*; U11 3(CURRENT_MODE)* 22(ADDR)* 23(~{INT}/OUT3)* 24(VCONN_~{FAULT})* 25(SDA/OUT1)* 26(SCL/OUT2)*

### Layout directives
differential pair; differential pair class USB3: CONN_RX1_N, CONN_RX1_P, CONN_RX2_N, CONN_RX2_P, CONN_TX1_N, CONN_TX1_P, CONN_TX2_N, CONN_TX2_P

### Notes on the sheet
- (near U11) 900mA/500mA max
- (near U11) Configured as DFP, Source only

### Library data of the parts
C53 = CMP-2000-06203-1: as C50 on sheet PCIe_USB30_Conn_Panel_Top; Datasheet URL: http://datasheet.octopart.com/EEEFK1C101P-Panasonic-datasheet-13266987.pdf; Package Description: 2-Pin Surface Mount Device, Body 6.6 x 6.6 mm; Manufacturer URL: http://www.panasonic.com/; Case Size/Dimension: Ø6.3x5.8mm; Series: FK; Datasheet Version: 11/2012; Mounting Technology: SurfaceMount; Package Reference: EEEFK1C101P; Operating Temp-Max: 105°C; Operating Temp Range: -55to+105°C
C54 = CMP-2008-02046-2: as C51 on sheet PCIe_USB30_Conn_Panel_Top; Package: C0402-BB; Temperature: -55°C to +125°C; ComponentLink2Description: Datasheet; Temperature Characteristic: X5R; Device Class L1: Passive Components; Height: 0.55mm; Lead Free: Yes; ComponentLink2URL: https://content.kemet.com/datasheets/KEM_C1002_X7R_SMD.pdf; Device Class L2: Capacitors; Temperature Range Low: -55°C; Temperature Range High: +125°C; RoHS: TRUE; Octopart: https://octopart.com/c0402c104k8pactu-kemet-140039; Automotive: No; Mouser Description: Capacitor 100 nF 10 VDC 0402; Category: Cap; Voltage Rating: 10 V; Digikey Description: CAP CER 0.1UF 10V X5R 0402; Ipc Land Pattern Name: CAPC10050X50; Device Class L3: Ceramic Capacitors
C55 = CMP-2000-05451-2: as C52 on sheet PCIe_USB30_Conn_Panel_Top; RoHS Compliant: Yes; Dielectric: X5R; Case Code (Imperial): 0805; Min Operating Temperature: -55°C; Capacitance: 47uF; Length: 2mm; Voltage Rating: 10V; Lead Free: Lead Free; Weight: 0.000194oz; Resistor Type: Ceramic; Dielectric Material: Ceramic; Max Operating Temperature: 85°C; Height: 1.25mm; Width: 0.049inch; Depth: 1.25mm; Termination: SMD/SMT; Case/Package: 0805; Voltage Rating (DC): 10V; Voltage: 10V; Thickness: 0.057inch; Tolerance: 20%; REACH SVHC: No SVHC; Package Quantity: 1; Series: C; Case Code (Metric): 2012; Mount: Surface Mount; Packaging: Tape and Reel
FB6 = CMP-08257-000403-1: as FB5 on sheet PCIe_USB30_Conn_Panel_Top; Length: 0.063inch; Max Operating Temperature: 125°C; Lead Free: Lead Free; Min Operating Temperature: -55°C; Test Frequency: 100MHz; Termination: SMD/SMT; Packaging: Tape and Reel; Package Quantity: 4000; Case Code (Metric): 1608; Series: MPZ; Max Current Rating: 1A; Mount: Surface Mount; Max DC Current: 1A; RoHS Compliant: Yes; Case/Package: 0603; Weight: 7.1E-05oz; Ratings: AEC-Q200; Height: 0.037inch; Width: 0.031inch; Case Code (Imperial): 0603
R26-R28 = CMP-1011-00768-4: as R22 on sheet PCIe_USB30_Conn_Panel_Top; RoHSCompliant: true; Length: 1 mm; DatasheetVersion: 04/2015; ComponentLink2URL: http://industrial.panasonic.com/cdbs/www-data/pdf/RDA0000/AOA0000C86.pdf; Mount: Surface Mount; PackageDescription: 2-Pin Surface Mount Device, Body 1 x 0.5 mm; Tolerance: 1%; Width: 0.5 mm; ComponentLink2Description: Datasheet; Packaging: Tape and Reel; REACH SVHC: No SVHC; Min Operating Temperature: -55 degC; Package Quantity: 10000; ComponentLink1Description: Manufacturer URL; Height: 0.35 mm; ComponentLink1URL: http://www.panasonic.com/; Mounting Technology: Surface Mount; Case Code (Imperial): 0402; PackageReference: 0402; Radiation Hardening: No; Pins: 2; Max Operating Temperature: 155 degC; Resistance: 200 KOhm; Case Code (Metric): 1005
R29 = CMP-1011-00844-2: as R25 on sheet PCIe_USB30_Conn_Panel_Top
U11 = CMP-04877-000019-1: as U7 on sheet PCIe_USB30_Conn_Panel_Top; Mount: Surface Mount; Max Operating Temperature: 70°C; Lead Free: Lead Free; RoHS Compliant: Yes; Packaging: Tape and Reel; Number of Pins: 30; Min Operating Temperature: 0°C; REACH SVHC: No SVHC
U12-U14 = CMP-04985-000004-1: as U8 on sheet PCIe_USB30_Conn_Panel_Top; Operating Supply Voltage: 5.5V; Reverse Standoff Voltage: 5.5V; Package: DQA0010A; Temperature Range Low: -40°C; Temperature Range High: +125°C; Ambient Temperature Range Low: -40°C; Device Class L1: Circuit Protection; Clamping Voltage: 14V; Manufacturer Part Number: TPD4E05U06QDQARQ1; Device Class L2: ESD and Circuit Protection ICs; Octopart: https://octopart.com/tpd4e05u06qdqarq1-texas+instruments-48523459; Device Class L3: unset; Height: 0.55mm; Automotive: Yes; ComponentLink2Description: Datasheet; RoHS: TRUE; Ambient Temperature Range High: +125°C; Category: IC; Mouser Description: Automotive 4-Channel ESD Protection Solution for SuperSpeed (up to 5 Gbps) Interface 10-USON -40 to 125; Temperature: -40°C to +125°C; ComponentLink2URL: http://www.ti.com/lit/ds/symlink/tpd4e05u06-q1.pdf; Digikey Description: TVS DIODE 5.5V 14V 10USON; Lead Free: Yes

## Sheet PCIe_USB30_Conn_Internal_Vertical.SchDoc
size A
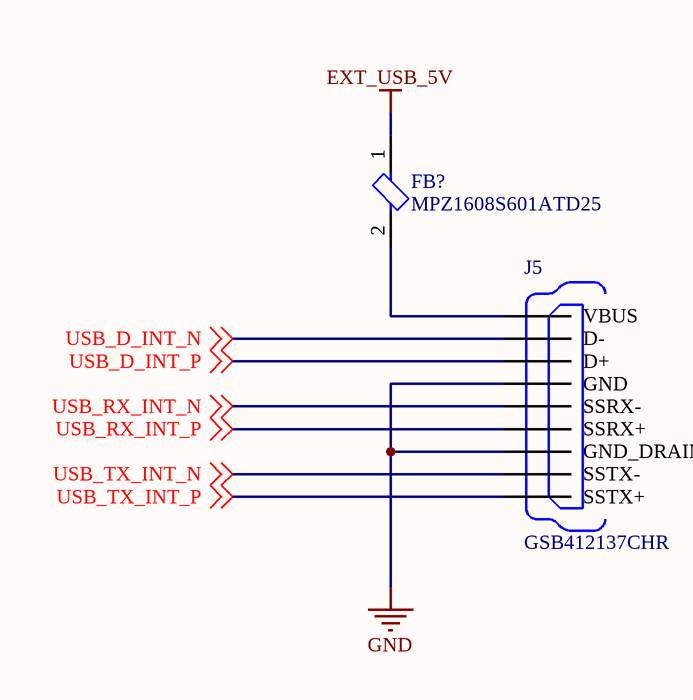
[diagram p13: PCIe_USB30_Conn_Internal_Vertical.SchDoc]

### Parts
FB?  MPZ1608S601ATD25  [FP-MPZ1608-0_8-IPC_B]
J5  GSB412137CHR  [AMPHENOL_GSB412137CHR]

### Nets
EXT_USB_5V: FB?.1
GND: J5.4(GND) J5.7(GND_DRAIN)
USB_D_INT_N: J5.2(D-) ; off-sheet USB_D_INT_N
USB_D_INT_P: J5.3(D+) ; off-sheet USB_D_INT_P
USB_RX_INT_N: J5.5(SSRX-) ; off-sheet USB_RX_INT_N
USB_RX_INT_P: J5.6(SSRX+) ; off-sheet USB_RX_INT_P
USB_TX_INT_N: J5.8(SSTX-) ; off-sheet USB_TX_INT_N
USB_TX_INT_P: J5.9(SSTX+) ; off-sheet USB_TX_INT_P
NetFB?_2: FB?.2 J5.1(VBUS)

### Library data of the parts
FB? = CMP-08257-000403-1: as FB5 on sheet PCIe_USB30_Conn_Panel_Top; Length: 0.063inch; Max Operating Temperature: 125°C; Lead Free: Lead Free; Min Operating Temperature: -55°C; Test Frequency: 100MHz; Termination: SMD/SMT; Packaging: Tape and Reel; Package Quantity: 4000; Case Code (Metric): 1608; Series: MPZ; Max Current Rating: 1A; Mount: Surface Mount; Max DC Current: 1A; RoHS Compliant: Yes; Case/Package: 0603; Weight: 7.1E-05oz; Ratings: AEC-Q200; Height: 0.037inch; Width: 0.031inch; Case Code (Imperial): 0603
J5 = GSB412137CHR: USB-A _USB TYPE-A_ USB 3.1 _USB 3.1 Gen 2, Superspeed+_ Receptacle Connector 9 Position Through Hole; MF: Amphenol ICC; MP: GSB412137CHR; Digi-Key_Part_Number: GSB412137CHR-ND; Package: None; Digi-Key_Purchase_URL: https://www.digikey.com/product-detail/en/amphenol-icc-commercial-products/GSB412137CHR/GSB412137CHR-ND/4883784?utm_source=snapeda&utm_medium=aggregator&utm_campaign=symbol; Value: *; SnapEDA_Link: https://www.snapeda.com/parts/GSB412137CHR/Amphenol%20FCI/view-part/480805/?ref=snap

## Nets that join several sheets
1V05: PCIe_USB30 (16 pins), PCIe_USB30_Power (C59.1 FB7.2)
1V8_CM4: CM4_Conn (CM4.88 CM4.90), Power (R67.2), Dip_Switch (C81.1 U18.5)
3V3: PCIe_UART_Bridge (26 pins), Power (C17.2 C18.1 R13.2 U3.1), External_Connectors (J1.11 J1.14 R11.2 U2.5), Dip_Switch (S1.10 S1.11), 40_Pin_Connector (J4.1 J4.17), PCIe_USB30 (C19.1 FB4.1), PCIe_USB30_Power (R30.2), PCIe_USB30_Conn_Panel_Top (C51.1 U7.8), PCIe_USB30_Conn_Panel_Bottom (C54.1 U11.8)
3V3_CM4: CM4_Conn (CM4.84 CM4.86), Power (R66.2), Dip_Switch (5 pins)
5V: CM4_Conn (6 pins), CM4_HDMI (C48.2 U4.1), Power (8 pins), 40_Pin_Connector (J4.2 J4.4), PCIe_USB30_Power (5 pins), PCIe_USB30_Conn_Panel_Top (5 pins), PCIe_USB30_Conn_Panel_Bottom (5 pins)
12V_PCIE: PCIe_Connector (5 pins), Power (C1.1 U1.2 U1.3)
EXT_USB_5V: PCIe_USB30_Power (C43.1 U6.6), PCIe_USB30_Conn_Panel_Top (C50.1 FB5.2 R25.2), PCIe_USB30_Conn_Panel_Bottom (C53.1 FB6.2 R29.2), PCIe_USB30_Conn_Internal_Vertical (FB?.1)
GND: CM4_Conn (50 pins), CM4_HDMI (12 pins), PCIe_UART_Bridge (76 pins), PCIe_Connector (9 pins), Power (16 pins), External_Connectors (14 pins), Dip_Switch (C80.2 C81.2 S1.8 U18.2), 40_Pin_Connector (8 pins), PCIe_USB30 (24 pins), PCIe_USB30_Power (12 pins), PCIe_USB30_Conn_Panel_Top (22 pins), PCIe_USB30_Conn_Panel_Bottom (18 pins), PCIe_USB30_Conn_Internal_Vertical (J5.4 J5.7)
USB_ANA_3V3: PCIe_USB30 (19 pins), PCIe_USB30_Power (R20.2)
CM4_PCIE_CLK_N: CM4_Conn (CM4.112), PCIe_USB30 (U5.22)
CM4_PCIE_CLK_P: CM4_Conn (CM4.110), PCIe_USB30 (U5.21)
CM4_PCIE_nCREQ: CM4_Conn (CM4.102), PCIe_USB30 (U5.30)
CM4_PCIE_nRST: CM4_Conn (CM4.109), PCIe_USB30 (U5.19)
CM4_PCIE_RX_N: CM4_Conn (CM4.118), PCIe_USB30 (U5.25)
CM4_PCIE_RX_P: CM4_Conn (CM4.116), PCIe_USB30 (U5.24)
CM4_PCIE_TX_N: CM4_Conn (CM4.124), PCIe_USB30 (C23.2)
CM4_PCIE_TX_P: CM4_Conn (CM4.122), PCIe_USB30 (C8.2)
CM4_UART_RX: CM4_Conn (CM4.55), Dip_Switch (S1.5), 40_Pin_Connector (J4.10)
CM4_UART_TX: CM4_Conn (CM4.51), Dip_Switch (S1.4), 40_Pin_Connector (J4.8)
CM4_USB_N: CM4_Conn (CM4.103), External_Connectors (J3.2)
CM4_USB_OTG: CM4_Conn (CM4.101), External_Connectors (R15.1 R16.2)
CM4_USB_P: CM4_Conn (CM4.105), External_Connectors (J3.3)
ETH_LED2: CM4_Conn (CM4.17), External_Connectors (R9.1)
ETH_LED3: CM4_Conn (CM4.15), External_Connectors (R10.1)
ETH_PAIR0_N: CM4_Conn (CM4.10), External_Connectors (J1.3)
ETH_PAIR0_P: CM4_Conn (CM4.12), External_Connectors (J1.2)
ETH_PAIR1_N: CM4_Conn (CM4.6), External_Connectors (J1.7)
ETH_PAIR1_P: CM4_Conn (CM4.4), External_Connectors (J1.4)
ETH_PAIR2_N: CM4_Conn (CM4.9), External_Connectors (J1.6)
ETH_PAIR2_P: CM4_Conn (CM4.11), External_Connectors (J1.5)
ETH_PAIR3_N: CM4_Conn (CM4.5), External_Connectors (J1.9)
ETH_PAIR3_P: CM4_Conn (CM4.3), External_Connectors (J1.8)
GNSS_RESET: CM4_Conn (CM4.25), 40_Pin_Connector (J4.40)
GPIO_0: CM4_Conn (CM4.36), Dip_Switch (S1.2), 40_Pin_Connector (J4.27)
GPIO_1: CM4_Conn (CM4.35), Dip_Switch (S1.3), 40_Pin_Connector (J4.28)
GPIO_2: CM4_Conn (CM4.58), 40_Pin_Connector (J4.3)
GPIO_3: CM4_Conn (CM4.56), 40_Pin_Connector (J4.5)
GPIO_4: CM4_Conn (CM4.54), 40_Pin_Connector (J4.7)
GPIO_5: CM4_Conn (CM4.34), 40_Pin_Connector (J4.29)
GPIO_6: CM4_Conn (CM4.30), 40_Pin_Connector (J4.31)
GPIO_7: CM4_Conn (CM4.37), 40_Pin_Connector (J4.26)
GPIO_8: CM4_Conn (CM4.39), 40_Pin_Connector (J4.24)
GPIO_9: CM4_Conn (CM4.40), 40_Pin_Connector (J4.21)
GPIO_10: CM4_Conn (CM4.44), 40_Pin_Connector (J4.19)
GPIO_11: CM4_Conn (CM4.38), 40_Pin_Connector (J4.23)
GPIO_12: CM4_Conn (CM4.31), 40_Pin_Connector (J4.32)
GPIO_13: CM4_Conn (CM4.28), 40_Pin_Connector (J4.33)
GPIO_16: CM4_Conn (CM4.29), 40_Pin_Connector (J4.36)
GPIO_17: CM4_Conn (CM4.50), 40_Pin_Connector (J4.11)
GPIO_18: CM4_Conn (CM4.49), 40_Pin_Connector (J4.12)
GPIO_19: CM4_Conn (CM4.26), 40_Pin_Connector (J4.35)
GPIO_20: CM4_Conn (CM4.27), 40_Pin_Connector (J4.38)
GPIO_22: CM4_Conn (CM4.46), 40_Pin_Connector (J4.15)
GPIO_23: CM4_Conn (CM4.47), 40_Pin_Connector (J4.16)
GPIO_24: CM4_Conn (CM4.45), 40_Pin_Connector (J4.18)
GPIO_25: CM4_Conn (CM4.41), 40_Pin_Connector (J4.22)
GPIO_26: CM4_Conn (CM4.24), 40_Pin_Connector (J4.37)
GPIO_27: CM4_Conn (CM4.48), 40_Pin_Connector (J4.13)
GPIO_VREF: CM4_Conn (CM4.78), Power (R66.1 R67.1)
HDMI0_CEC: CM4_Conn (CM4.151), CM4_HDMI (J2.15)
HDMI0_CLK_N: CM4_Conn (CM4.190), CM4_HDMI (J2.14)
HDMI0_CLK_P: CM4_Conn (CM4.188), CM4_HDMI (J2.12)
HDMI0_HP: CM4_Conn (CM4.153), CM4_HDMI (J2.1)
HDMI0_SCL: CM4_Conn (CM4.200), CM4_HDMI (J2.17)
HDMI0_SDA: CM4_Conn (CM4.199), CM4_HDMI (J2.18)
HDMI0_TX0_N: CM4_Conn (CM4.184), CM4_HDMI (J2.11)
HDMI0_TX0_P: CM4_Conn (CM4.182), CM4_HDMI (J2.9)
HDMI0_TX1_N: CM4_Conn (CM4.178), CM4_HDMI (J2.8)
HDMI0_TX1_P: CM4_Conn (CM4.176), CM4_HDMI (J2.6)
HDMI0_TX2_N: CM4_Conn (CM4.172), CM4_HDMI (J2.5)
HDMI0_TX2_P: CM4_Conn (CM4.170), CM4_HDMI (J2.3)
nEXTRST: CM4_Conn (CM4.100), PCIe_USB30 (U5.31), PCIe_USB30_Power (R19.2)
nRPIBOOT: CM4_Conn (CM4.93), Dip_Switch (S1.9)
PCIE_CLK_N: PCIe_UART_Bridge (U16.F4), PCIe_Connector (C45.2)
PCIE_CLK_P: PCIe_UART_Bridge (U16.E4), PCIe_Connector (C44.2)
PCIE_PERST: PCIe_UART_Bridge (U16.J2), PCIe_Connector (P2.A11 R3.1)
PCIE_RX_N: PCIe_UART_Bridge (U16.E2), PCIe_Connector (P2.B15)
PCIE_RX_P: PCIe_UART_Bridge (U16.E1), PCIe_Connector (P2.B14)
PCIE_TX_N: PCIe_UART_Bridge (U16.G2), PCIe_Connector (C47.2)
PCIE_TX_P: PCIe_UART_Bridge (U16.G1), PCIe_Connector (C46.2)
PCIe_UART_RX0: PCIe_UART_Bridge (U16.J9), Dip_Switch (S1.15)
PCIe_UART_RX1: PCIe_UART_Bridge (U16.G10), Dip_Switch (S1.13)
PCIe_UART_TX0: PCIe_UART_Bridge (U16.K9), Dip_Switch (S1.14)
PCIe_UART_TX1: PCIe_UART_Bridge (U16.H10), Dip_Switch (S1.12)
SD_CLK: CM4_Conn (CM4.57), External_Connectors (SD1.5)
SD_CMD: CM4_Conn (CM4.62), External_Connectors (SD1.3)
SD_DAT0: CM4_Conn (CM4.63), External_Connectors (SD1.7)
SD_DAT1: CM4_Conn (CM4.67), External_Connectors (SD1.8)
SD_DAT2: CM4_Conn (CM4.69), External_Connectors (SD1.1)
SD_DAT3: CM4_Conn (CM4.61), External_Connectors (SD1.2)
SD_PWR_ON: CM4_Conn (CM4.75), External_Connectors (R11.1 U2.4)
USB_D1_N: PCIe_USB30 (U5.68), PCIe_USB30_Conn_Panel_Bottom (J6.A7-B J6.B7-B U14.1 U14.10)
USB_D1_P: PCIe_USB30 (U5.67), PCIe_USB30_Conn_Panel_Bottom (J6.A6-B J6.B6-B U14.2 U14.9)
USB_D2_N: PCIe_USB30 (U5.17), PCIe_USB30_Conn_Panel_Top (J6.A7-A J6.B7-A U10.1 U10.10)
USB_D2_P: PCIe_USB30 (U5.16), PCIe_USB30_Conn_Panel_Top (J6.A6-A J6.B6-A U10.2 U10.9)
USB_D_INT_N: PCIe_USB30 (U5.59), PCIe_USB30_Conn_Internal_Vertical (J5.2)
USB_D_INT_P: PCIe_USB30 (U5.58), PCIe_USB30_Conn_Internal_Vertical (J5.3)
USB_nOC: PCIe_USB30 (5 pins), PCIe_USB30_Power (U6.4)
USB_nPWR: PCIe_USB30 (U5.44), PCIe_USB30_Power (Q1.1 R20.1)
USB_RX1_N: PCIe_USB30 (U5.65), PCIe_USB30_Conn_Panel_Bottom (U11.7)
USB_RX1_P: PCIe_USB30 (U5.64), PCIe_USB30_Conn_Panel_Bottom (U11.6)
USB_RX2_N: PCIe_USB30 (U5.14), PCIe_USB30_Conn_Panel_Top (U7.6)
USB_RX2_P: PCIe_USB30 (U5.13), PCIe_USB30_Conn_Panel_Top (U7.7)
USB_RX_INT_N: PCIe_USB30 (U5.56), PCIe_USB30_Conn_Internal_Vertical (J5.5)
USB_RX_INT_P: PCIe_USB30 (U5.55), PCIe_USB30_Conn_Internal_Vertical (J5.6)
USB_TX1_N: PCIe_USB30 (C14.1), PCIe_USB30_Conn_Panel_Bottom (U11.10)
USB_TX1_P: PCIe_USB30 (C13.1), PCIe_USB30_Conn_Panel_Bottom (U11.9)
USB_TX2_N: PCIe_USB30 (C22.1), PCIe_USB30_Conn_Panel_Top (U7.9)
USB_TX2_P: PCIe_USB30 (C21.1), PCIe_USB30_Conn_Panel_Top (U7.10)
USB_TX_INT_N: PCIe_USB30 (C79.1), PCIe_USB30_Conn_Internal_Vertical (J5.8)
USB_TX_INT_P: PCIe_USB30 (C78.1), PCIe_USB30_Conn_Internal_Vertical (J5.9)

## Assembly variants
Main Variant: not fitted R40 R50 R51 R67